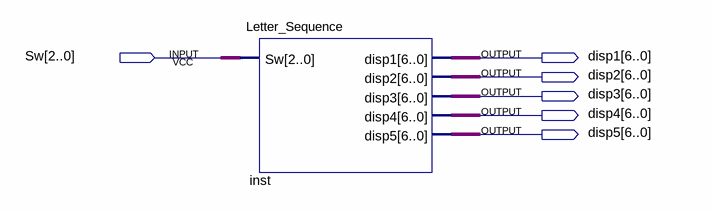
[diagram p0: schematic sheet]
// Quartus schematic Ex1.bdf as structural Verilog: 1 symbols, 6 pins
module Ex1 (
  input  [2:0] Sw,
  output [6:0] disp1,
  output [6:0] disp2,
  output [6:0] disp3,
  output [6:0] disp4,
  output [6:0] disp5
);

  Letter_Sequence inst (.Sw(Sw), .disp1(disp1), .disp2(disp2), .disp3(disp3), .disp4(disp4), .disp5(disp5));
endmodule
